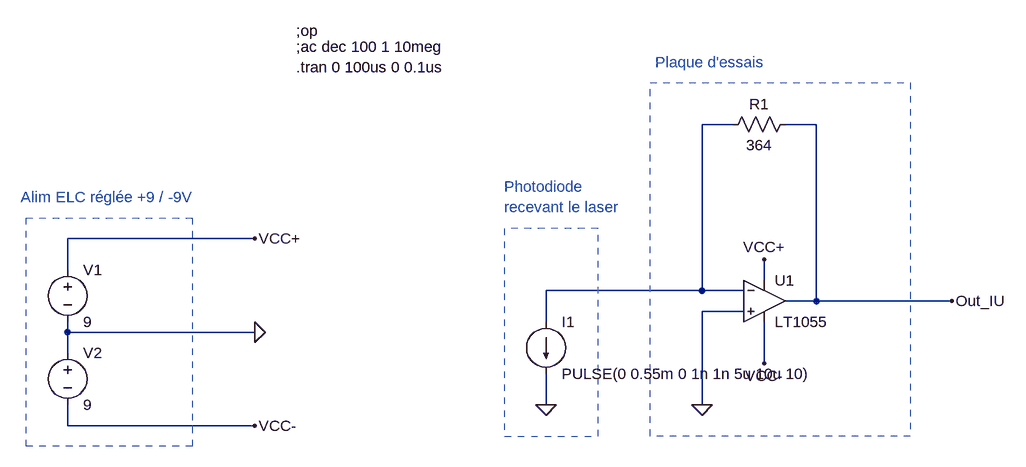
[diagram p0: schematic Draft2.asc]
Draft2.asc, the LTspice schematic file:
Version 4
SHEET 1 1184 680
WIRE 752 -240 704 -240
WIRE 880 -240 832 -240
WIRE 16 -64 -272 -64
WIRE -272 -16 -272 -64
WIRE 800 0 800 -32
WIRE 704 16 704 -240
WIRE 704 16 464 16
WIRE 768 16 704 16
WIRE 880 32 880 -240
WIRE 880 32 832 32
WIRE 1088 32 880 32
WIRE 768 48 704 48
WIRE 464 64 464 16
WIRE -272 80 -272 64
WIRE 16 80 -272 80
WIRE -272 112 -272 80
WIRE 800 128 800 64
WIRE 464 192 464 144
WIRE 704 192 704 48
WIRE -272 224 -272 192
WIRE 16 224 -272 224
FLAG 16 80 0
FLAG 16 -64 VCC+
FLAG 16 224 VCC-
FLAG 800 -32 VCC+
FLAG 800 128 VCC-
FLAG 704 192 0
FLAG 464 192 0
FLAG 1088 32 Out_IU
SYMBOL voltage -272 -32 R0
WINDOW 123 0 0 Left 2
WINDOW 39 0 0 Left 2
SYMATTR InstName V1
SYMATTR Value 9
SYMBOL voltage -272 96 R0
WINDOW 123 0 0 Left 2
WINDOW 39 0 0 Left 2
SYMATTR InstName V2
SYMATTR Value 9
SYMBOL res 848 -256 R90
WINDOW 0 0 56 VBottom 2
WINDOW 3 32 56 VTop 2
SYMATTR InstName R1
SYMATTR Value 364
SYMBOL Opamps\\LT1055 800 -32 R0
SYMATTR InstName U1
SYMBOL current 464 64 R0
WINDOW 123 0 0 Left 2
WINDOW 39 0 0 Left 2
SYMATTR InstName I1
SYMATTR Value PULSE(0 0.55m 0 1n 1n 5u 10u 10)
TEXT -344 -128 Left 2 ;Alim ELC réglée +9 / -9V
TEXT 400 -144 Left 2 ;Photodiode \nrecevant le laser
TEXT 632 -336 Left 2 ;Plaque d'essais
TEXT 80 -384 Left 2 !;op
TEXT 80 -360 Left 2 !;ac dec 100 1 10meg
TEXT 80 -328 Left 2 !.tran 0 100us 0 0.1us
RECTANGLE Normal -80 256 -336 -96 2
RECTANGLE Normal 1024 240 624 -304 2
RECTANGLE Normal 400 240 544 -80 2

The netlist it stands for:
* Draft2.asc
V1 VCC+ 0 9
V2 0 VCC- 9
R1 Out_IU N001 364
XU1 0 N001 VCC+ VCC- Out_IU LT1055  ; pins In+ In- V+ V- OUT
I1 N001 0 PULSE(0 0.55m 0 1n 1n 5u 10u 10)
* Alim ELC réglée +9 / -9V
* Photodiode
* recevant le laser
* Plaque d'essais
;op
;ac dec 100 1 10meg
.tran 0 100us 0 0.1us
.backanno
.end

* Results of the author's LTspice run, read from the files saved beside the schematic
* Operating Point, zero values left out:
*   V(vcc+) = 9 V
*   V(vcc-) = -9 V
*   I(V2) = -2.8 mA
*   I(V1) = -2.8 mA
*   Ix(u1:3) = 2.8 mA
*   Ix(u1:4) = -2.8 mA
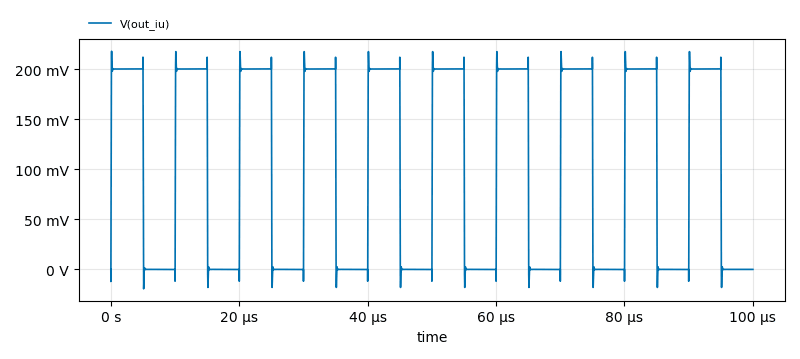
[diagram p1: Transient Analysis of Draft2.asc, plotted from the saved traces]
* Transient Analysis, 1 run:
*   V(out_iu): min -19.43 mV, max 218 mV, average 100.1 mV, rms 141.4 mV, last 0 V